# EAGLE design extruder_pcb (EAGLE 7.5.0)
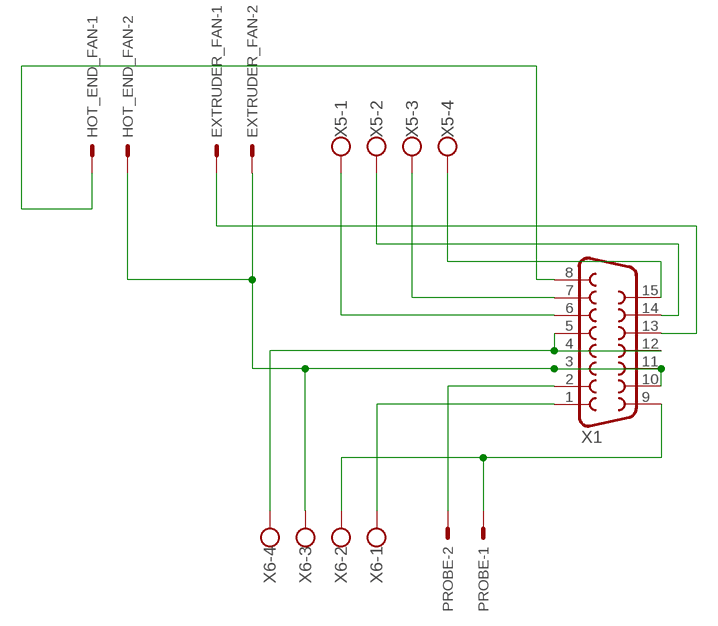
[diagram p0: schematic, sheet 1]

## Parts
EXTRUDER_FAN  KK-156-2  [KK-156-2]
HOT_END_FAN  KK-156-2  [KK-156-2]
PROBE  KK-156-2  [KK-156-2]
X1  F15VB  [F15VB]
X5  W237-4  [W237-4]
X6  W237-4  [W237-4]

## Nets
N$1: X1.1 X6.1
N$2: PROBE.2 X1.2
N$3 [supply]: EXTRUDER_FAN.2 HOT_END_FAN.2 X1.3 X1.10 X1.11 X6.3
N$4 [supply]: X1.4 X1.5 X1.12 X6.4
N$5 [supply]: PROBE.1 X1.9 X6.2
N$6 [supply]: EXTRUDER_FAN.1 X1.13
N$7: X1.6 X5.1
N$8: X1.14 X5.2
N$9: X1.7 X5.3
N$10: X1.15 X5.4
N$11: HOT_END_FAN.1 X1.8

## Library data of the parts
EXTRUDER_FAN HOT_END_FAN PROBE = con-molex:KK-156-2: KK 156 HEADER Source: http://www.molex.com/pdm_docs/sd/026604100_sd.pdf; OC_FARNELL: unknown; OC_NEWARK: unknown
X1 = con-subd:F15: SUB-D; OC_FARNELL: unknown; OC_NEWARK: unknown
X5 X6 = con-wago-500:W237-4: WAGO SCREW CLAMP; OC_FARNELL: unknown; OC_NEWARK: unknown

## Net classes
0 default: width 0.5 mm
1 supply: width 1.5 mm

## Board
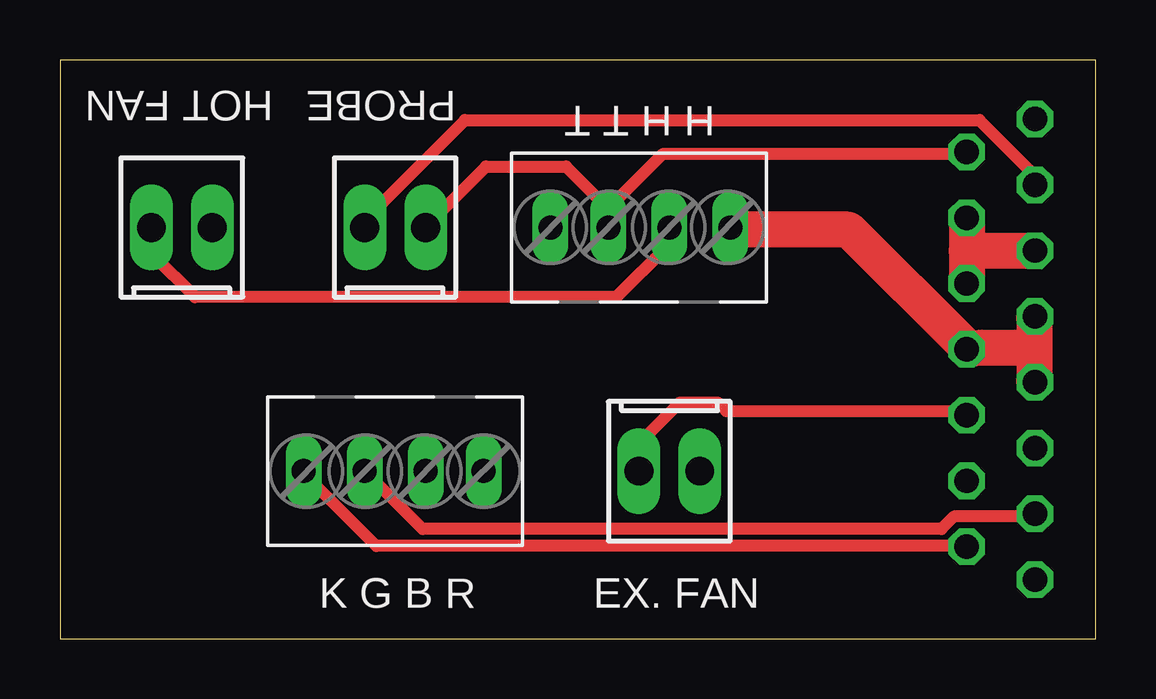
[diagram p1: board, top side]
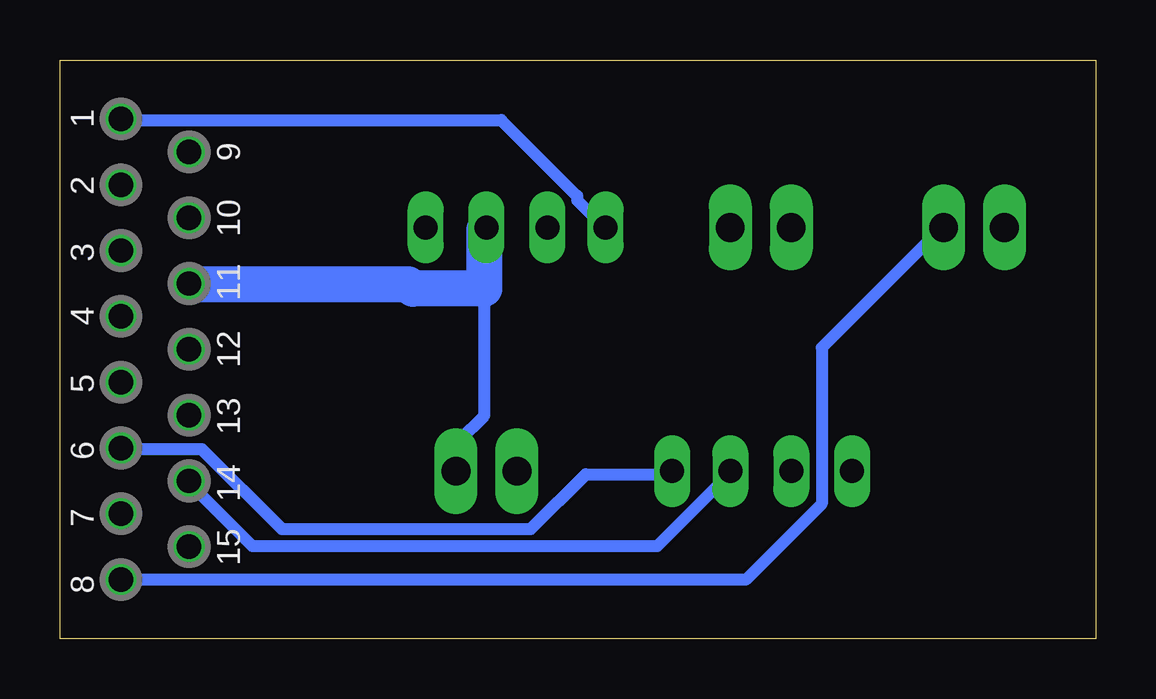
[diagram p2: board, bottom side, seen from below]

Size 43.18 x 24.13 mm. Coordinates in mm from the lower left corner, seen from the top.
Outline: 0,0 43.18,0 43.18,24.13 0,24.13 0,0
Copper layers (1*16): Top 0.035mm / dielectric 1.5mm / Bottom 0.035mm
Design rules "default": minimum track width 10mil, minimum drill 24mil, track to track 8mil, track to pad 8mil, pad to pad 8mil, via to via 8mil, smd to smd 8mil, copper to edge 40mil, drill to drill 8mil, minimum pad ring 10mil, minimum via ring 8mil, stop-mask expansion 4mil, vias tented up to drill 0mil, thermal gap 10mil

### Footprints (pad centres in the part's own frame; a part is rotated, then mirrored left to right if it is on the bottom)
KK-156-2 = drill 1.2 long: 1 -1.27,0; 2 1.27,0
F15VB = drill 1.016 octagon: 1 -9.601,-1.422; 2 -6.858,-1.422; 3 -4.115,-1.422; 4 -1.372,-1.422; 5 1.372,-1.422; 6 4.115,-1.422; 7 6.858,-1.422; 8 9.601,-1.422; 9 -8.23,1.422; 10 -5.486,1.422; 11 -2.743,1.422; 12 0,1.422; 13 2.743,1.422; 14 5.486,1.422; 15 8.23,1.422
W237-4 = drill 1 long: 1 -3.69,0; 2 -1.27,0; 3 1.27,0; 4 3.81,0

### Placement (x,y rotation side)
EXTRUDER_FAN  25.4,6.99 0 top
HOT_END_FAN  5.08,17.14 180 top
PROBE  13.97,17.14 180 top
X1  39.22,12.06 270 bottom
X5  13.97,6.99 180 top
X6  24.13,17.14 0 top

### Tracks (layer width: path | path; a pad name or v marks a point on that pad's centre or on a via)
N$1
  Bottom 0.5: X6.1 20.57,17.23 21.62,18.28 21.62,18.46 24.79,21.62 40.61,21.62 X1.1
N$2
  Top 0.5: X1.2 40.61,18.99 40.61,19.34 38.32,21.62 16.88,21.62 12.83,17.58 12.83,17.23 PROBE.2
N$3
  Top 0.5: HOT_END_FAN.2 3.87,17.05 3.87,16 5.63,14.24 23.21,14.24 25.32,16.35 25.32,17.05 X6.3
  Top 1.5: 37.8,16.17 37.8,17.4 X1.10 | 37.8,16.17 37.8,14.94 X1.11 | 37.8,16.17 40.61,16.17 X1.3
  Bottom 0.5: 25.49,14.59 25.49,9.32 26.55,8.26 26.55,7.03 EXTRUDER_FAN.2
  Bottom 1.5: X6.3 25.49,17.05 25.49,14.59 28.48,14.59 28.66,14.77 37.8,14.77 X1.11
N$4
  Top 1.5: 40.61,12.13 40.61,13.36 X1.4 | 40.61,12.13 40.61,10.72 X1.5 | X6.4 27.95,17.05 32.88,17.05 37.8,12.13 X1.12 38.5,12.13 40.61,12.13
N$5
  Top 0.5: 22.85,17.93 22.85,17.23 X6.2 | 22.85,17.93 21.1,19.69 17.76,19.69 15.29,17.23 PROBE.1 | 22.85,17.93 25.14,20.22 37.8,20.22 X1.9
N$6
  Top 0.5: X1.13 37.8,9.49 27.78,9.49 27.43,9.85 25.84,9.85 24.26,8.26 24.26,7.03 EXTRUDER_FAN.1
N$7
  Bottom 0.5: X5.1 17.76,6.86 21.27,6.86 23.56,4.57 33.93,4.57 37.27,7.91 40.61,7.91 X1.6
N$8
  Bottom 0.5: X5.2 15.29,6.86 18.28,3.87 35.16,3.87 37.8,6.5 X1.14
N$9
  Top 0.5: X5.3 12.83,6.86 15.12,4.57 36.74,4.57 37.27,5.1 40.61,5.1 X1.7
N$10
  Top 0.5: X5.4 10.2,6.86 13.19,3.87 37.8,3.87 X1.15
N$11
  Bottom 0.5: X1.8 40.61,2.46 14.59,2.46 11.43,5.63 11.43,12.13 6.5,17.05 HOT_END_FAN.1

### Text on the board
tNames: HOT FAN | PROBE | H H T T | K G B R | EX. FAN